# EasyEDA Pro project ProPrj_UNO_SIG_pro_2026-06-11.epro

# Schematic UNO_SIG
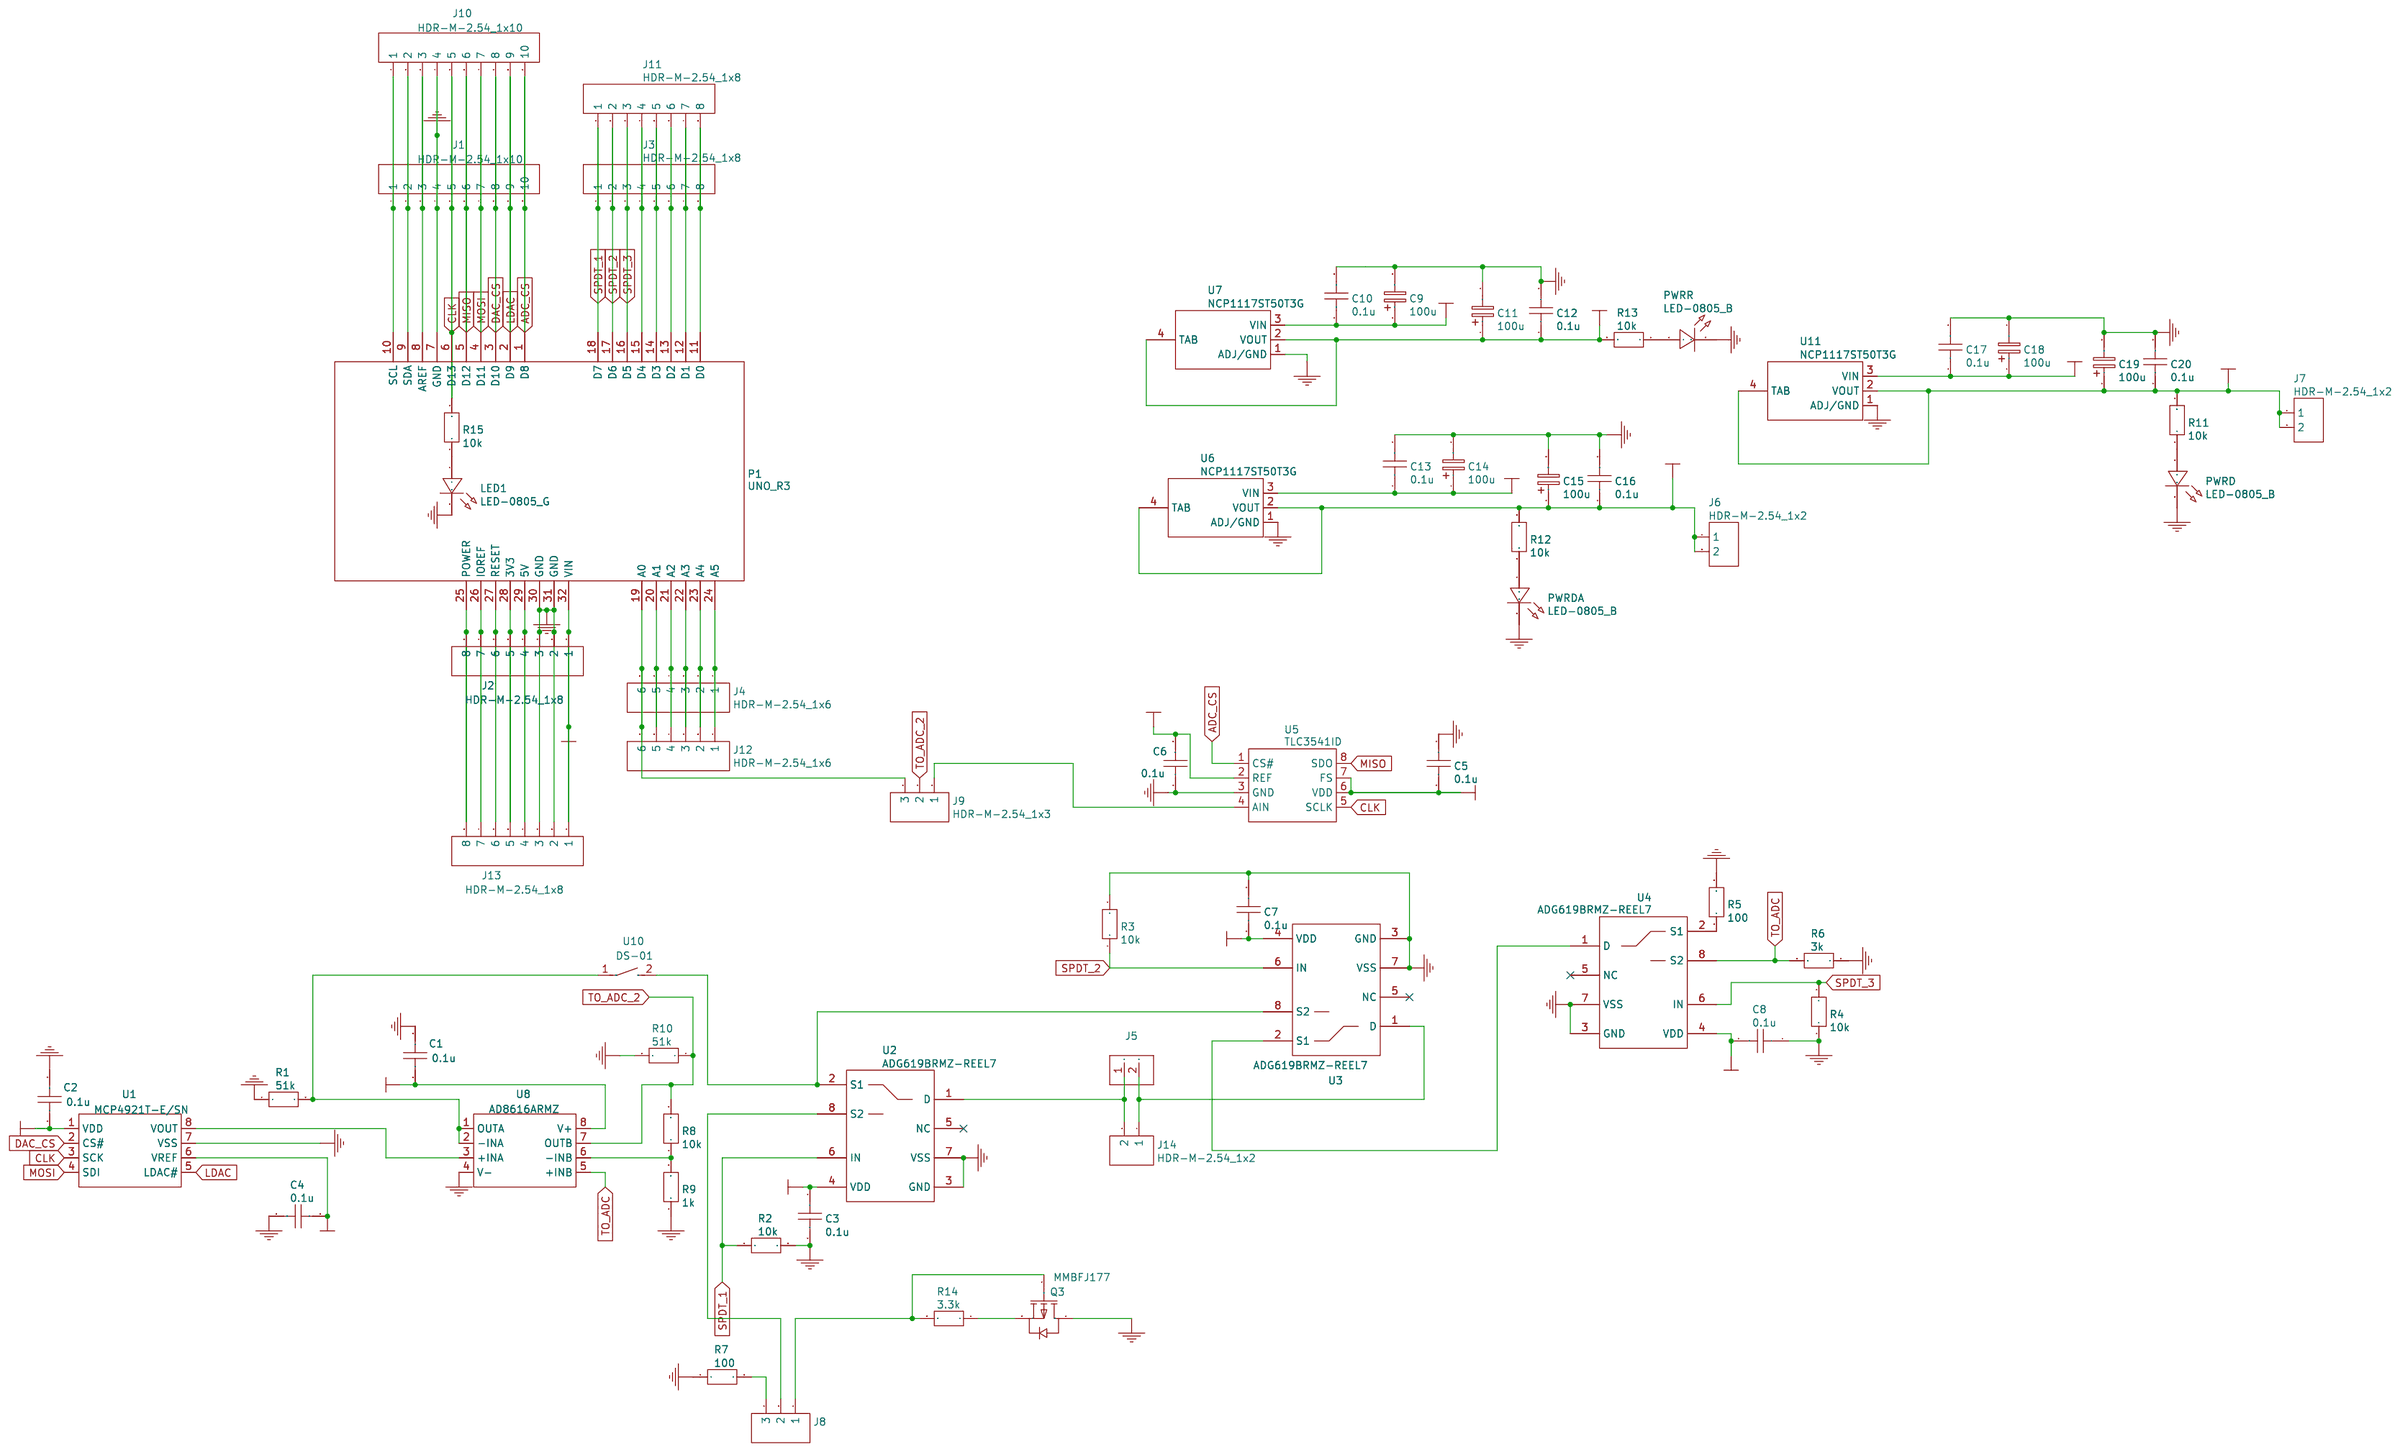
[diagram p0: schematic sheet]

## Parts
C1  0.1u  [C0805]
C2  0.1u  [C0805]
C3  0.1u  [C0805]
C4  0.1u  [C0805]
C5  0.1u  [C0805]
C6  0.1u  [C0805]
C7  0.1u  [C0805]
C8  0.1u  [C0805]
C9  100u  [CAP-D8.0×F3.5]
C10  0.1u  [C0805]
C11  100u  [CAP-D8.0×F3.5]
C12  0.1u  [C0805]
C13  0.1u  [C0805]
C14  100u  [CAP-D8.0×F3.5]
C15  100u  [CAP-D8.0×F3.5]
C16  0.1u  [C0805]
C17  0.1u  [C0805]
C18  100u  [CAP-D8.0×F3.5]
C19  100u  [CAP-D8.0×F3.5]
C20  0.1u  [C0805]
J1  HDR-M-2.54_1x10  [HDR-M-2.54_1X10]
J2  HDR-M-2.54_1x8  [HDR-M-2.54_1X8]
J3  HDR-M-2.54_1x8  [HDR-M-2.54_1X8]
J4  HDR-M-2.54_1x6  [HDR-M-2.54_1X6]
J5  CON_TERMINAL_BLOCK_02-5MM  [TERMINAL_BLOCK_2P_5]
J6  HDR-M-2.54_1x2  [HDR-M-2.54_1X2]
J7  HDR-M-2.54_1x2  [HDR-M-2.54_1X2]
J8  HDR-M-2.54_1x3  [HDR-M-2.54_1X3]
J9  HDR-M-2.54_1x3  [HDR-M-2.54_1X3]
J10  HDR-M-2.54_1x10  [HDR-M-2.54_1X10]
J11  HDR-M-2.54_1x8  [HDR-M-2.54_1X8]
J12  HDR-M-2.54_1x6  [HDR-M-2.54_1X6]
J13  HDR-M-2.54_1x8  [HDR-M-2.54_1X8]
J14  HDR-M-2.54_1x2  [HDR-M-2.54_1X2]
LED1  LED-0805_G  [LED0805_GREEN]
P1  UNO_R3
PWRD  LED-0805_B  [LED0805_BLUE]
PWRDA  LED-0805_B  [LED0805_BLUE]
PWRR  LED-0805_B  [LED0805_BLUE]
Q3  MMBFJ177  [SOT-23-3_L3.0-W1.7-P0.95-LS2.9-BR]
R1  51k  [R1206]
R2  10k  [R1206]
R3  10k  [R1206]
R4  10k  [R1206]
R5  100  [R1206]
R6  3k  [R1206]
R7  100  [R1206]
R8  10k  [R1206]
R9  1k  [R1206]
R10  51k  [R1206]
R11  10k  [R1206]
R12  10k  [R1206]
R13  10k  [R1206]
R14  3.3k  [R1206]
R15  10k  [R1206]
U1  MCP4921T-E/SN  [SOIC-8_L4.9-W3.9-P1.27-LS6.0-BL-2]
U2  ADG619BRMZ-REEL7  [MSOP-8_L3.0-W3.0-P0.65-LS4.9-TL]
U3  ADG619BRMZ-REEL7  [MSOP-8_L3.0-W3.0-P0.65-LS4.9-TL]
U4  ADG619BRMZ-REEL7  [MSOP-8_L3.0-W3.0-P0.65-LS4.9-TL]
U5  TLC3541ID  [SOIC-8_L4.9-W3.9-P1.27-LS6.0-BL]
U6  NCP1117ST50T3G  [SOT-223_L6.5-W3.5-P2.30-LS7.0-BR]
U7  NCP1117ST50T3G  [SOT-223_L6.5-W3.5-P2.30-LS7.0-BR]
U8  AD8616ARMZ  [MSOP-8_L3.0-W3.0-P0.65-LS4.9-BL]
U10  DS-01  [SW-TH_DS-01]
U11  NCP1117ST50T3G  [SOT-223_L6.5-W3.5-P2.30-LS7.0-BR]

## Library data of the parts
C1-C8 C10 C12 C13 C16 C17 C20 = 0.1u
C9 C11 C14 C15 C18 C19 = 100u
J1 J10 = HDR-M-2.54_1x10: Supplier Part: C57369; Supplier: LCSC
J2 J3 J11 J13 = HDR-M-2.54_1x8: Supplier Part: C190820; Supplier: LCSC
J4 J12 = HDR-M-2.54_1x6: Supplier Part: C190819; Supplier: LCSC
J5 = CON_TERMINAL_BLOCK_02-5MM
J6 J7 J14 = HDR-M-2.54_1x2: Supplier Part: C124375; Supplier: LCSC
J8 J9 = HDR-M-2.54_1x3: Supplier Part: C180248; Supplier: LCSC
LED1 = LED-0805_G: Manufacturer: 国星光电; Manufacturer Part: NCD0805G1; Supplier Part: C84260
P1 = UNO_R3
PWRD PWRDA PWRR = LED-0805_B: Manufacturer: 方舟 ARKLED; Manufacturer Part: D-B080508B1-KS2; Supplier Part: C108412
Q3 = MMBFJ177: Supplier: LCSC; Supplier Part: C232842; Manufacturer: onsemi(安森美); JLCPCB Part Class: Extended Part
R1 R10 = 51k
R2-R4 R8 R11-R13 R15 = 10k
R5 R7 = 100
R6 = 3k
R9 = 1k
R14 = 3.3k
U1 = MCP4921T-E/SN: Supplier: LCSC; Supplier Part: C623659; Manufacturer: MICROCHIP(美国微芯); JLCPCB Part Class: Extended Part; link: https://lcsc.com/eda_search?q=C623659&amp;%26type=1&amp;ref=editor
U2-U4 = ADG619BRMZ-REEL7: Supplier: LCSC; Manufacturer: ADI(亚德诺)/LINEAR(凌特); Supplier Part: C141957; JLCPCB Part Class: Extended Part; link: https://lcsc.com/eda_search?q=C141957&amp;%26type=1&amp;ref=editor
U5 = TLC3541ID: Supplier: LCSC; Supplier Part: C1543741; Manufacturer: TI(德州仪器); JLCPCB Part Class: Extended Part; link: https://lcsc.com/eda_search?q=C1543741&amp;%26type=1&amp;ref=editor
U6 U7 U11 = NCP1117ST50T3G: Supplier: LCSC; Manufacturer: onsemi(安森美); Supplier Part: C17314; JLCPCB Part Class: Extended Part; link: https://lcsc.com/eda_search?q=C17314&amp;%26type=1&amp;ref=editor
U8 = AD8616ARMZ: Supplier: LCSC; Supplier Part: C578786; Manufacturer: ADI(亚德诺)/LINEAR(凌特); JLCPCB Part Class: Extended Part; link: https://lcsc.com/eda_search?q=C578786&amp;%26type=1&amp;ref=editor
U10 = DS-01: Supplier: LCSC; Supplier Part: C9900001390; Manufacturer: null; JLCPCB Part Class: Extended Part; link: https://lcsc.com/eda_search?q=C9900001390&amp;%26type=1&amp;ref=editor

## Nets
+12V: C9.1 C10.1 C13.1 C14.1 C17.1 C18.1 J2.1 J13.1 P1.32(VIN) U6.3(VIN) U7.3(VIN) U11.3(VIN)
GND: C1.2 C2.2 C3.2 C4.2 C5.2 C6.1 C7.1 C8.1 C9.2 C10.2 C11.2 C12.2 C13.2 C14.2 C15.2 C16.2 C17.2 C18.2 C19.2 C20.2 J1.4 J2.2 J2.3 J10.4 J13.2 J13.3 LED1.2 P1.7(GND) P1.30(GND) P1.31(GND) PWRD.2 PWRDA.2 PWRR.2 Q3.1(D) R1.1 R2.2 R3.2 R4.1 R5.2 R6.1 R7.1 R9.1 R10.2 U1.7(VSS) U2.3(GND) U2.7(VSS) U3.3(GND) U3.7(VSS) U4.3(GND) U4.7(VSS) U5.3(GND) U6.1(ADJ/GND) U7.1(ADJ/GND) U8.4(V-) U11.1(ADJ/GND)
VCCA: C1.1 C3.1 C7.2 C8.2 C15.1 C16.1 J6.1 J6.2 R12.2 U2.4(VDD) U3.4(VDD) U4.4(VDD) U6.2(VOUT) U6.4(TAB) U8.8(V+)
VCCD: C2.1 C5.1 C19.1 C20.1 J7.1 J7.2 R11.2 U1.1(VDD) U5.6(VDD) U5.7(FS) U11.2(VOUT) U11.4(TAB)
VCCREF: C4.1 C6.2 C11.1 C12.1 R13.2 U1.6(VREF) U5.2(REF) U7.2(VOUT) U7.4(TAB)
ADC_CS: J1.10 J10.10 P1.1(D8) U5.1(CS#)
CLK: J1.5 J10.5 P1.6(D13) R15.2 U1.3(SCK) U5.5(SCLK)
DAC_CS: J1.8 J10.8 P1.3(D10) U1.2(CS#)
LDAC: J1.9 J10.9 P1.2(D9) U1.5(LDAC#)
MISO: J1.6 J10.6 P1.5(D12) U5.8(SDO)
MOSI: J1.7 J10.7 P1.4(D11) U1.4(SDI)
SPDT_1: J3.1 J11.1 P1.18(D7) R2.1 U2.6(IN)
SPDT_2: J3.2 J11.2 P1.17(D6) R3.1 U3.6(IN)
SPDT_3: J3.3 J11.3 P1.16(D5) R4.2 U4.6(IN)
TO_ADC: R6.2 U4.8(S2) U8.5(+INB)
TO_ADC_2: J9.2 R8.2 R10.1 U8.7(OUTB)
J8_3: J8.3 R7.2
LED1_1: LED1.1 R15.1
Net-(J1-1): J1.1 J10.1 P1.10(SCL)
Net-(J1-2): J1.2 J10.2 P1.9(SDA)
Net-(J1-3): J1.3 J10.3 P1.8(AREF)
Net-(J2-4): J2.4 J13.4 P1.29(5V)
Net-(J2-5): J2.5 J13.5 P1.28(3V3)
Net-(J2-6): J2.6 J13.6 P1.27(RESET)
Net-(J2-7): J2.7 J13.7 P1.26(IOREF)
Net-(J2-8): J2.8 J13.8 P1.25(POWER)
Net-(J3-4): J3.4 J11.4 P1.15(D4)
Net-(J3-5): J3.5 J11.5 P1.14(D3)
Net-(J3-6): J3.6 J11.6 P1.13(D2)
Net-(J3-7): J3.7 J11.7 P1.12(D1)
Net-(J3-8): J3.8 J11.8 P1.11(D0)
Net-(J4-1): J4.1 J12.1 P1.24(A5)
Net-(J4-2): J4.2 J12.2 P1.23(A4)
Net-(J4-3): J4.3 J12.3 P1.22(A3)
Net-(J4-4): J4.4 J12.4 P1.21(A2)
Net-(J4-5): J4.5 J12.5 P1.20(A1)
Net-(J4-6): J4.6 J9.3 J12.6 P1.19(A0)
PWRD_1: PWRD.1 R11.1
Q3_2: Q3.2(S) R14.1
Q3_3: J8.1 Q3.3(G) R14.2
R8_1: R8.1 R9.2 U8.6(-INB)
R12_1: PWRDA.1 R12.1
R13_1: PWRR.1 R13.1
U1_8: U1.8(VOUT) U8.3(+INA)
U2_1: J5.1 J14.2 U2.1(D)
U2_2: U2.2(S1) U3.8(S2) U10.2
U2_8: J8.2 U2.8(S2)
U3_1: J5.2 J14.1 U3.1(D)
U3_2: U3.2(S1) U4.1(D)
U4_2: R5.1 U4.2(S1)
U5_4: J9.1 U5.4(AIN)
U10_1: R1.2 U8.1(OUTA) U8.2(-INA) U10.1

Not connected (* = marked no-connect by the designer): U2 5(NC)*; U3 5(NC)*; U4 5(NC)*

# Board UNO_SIG
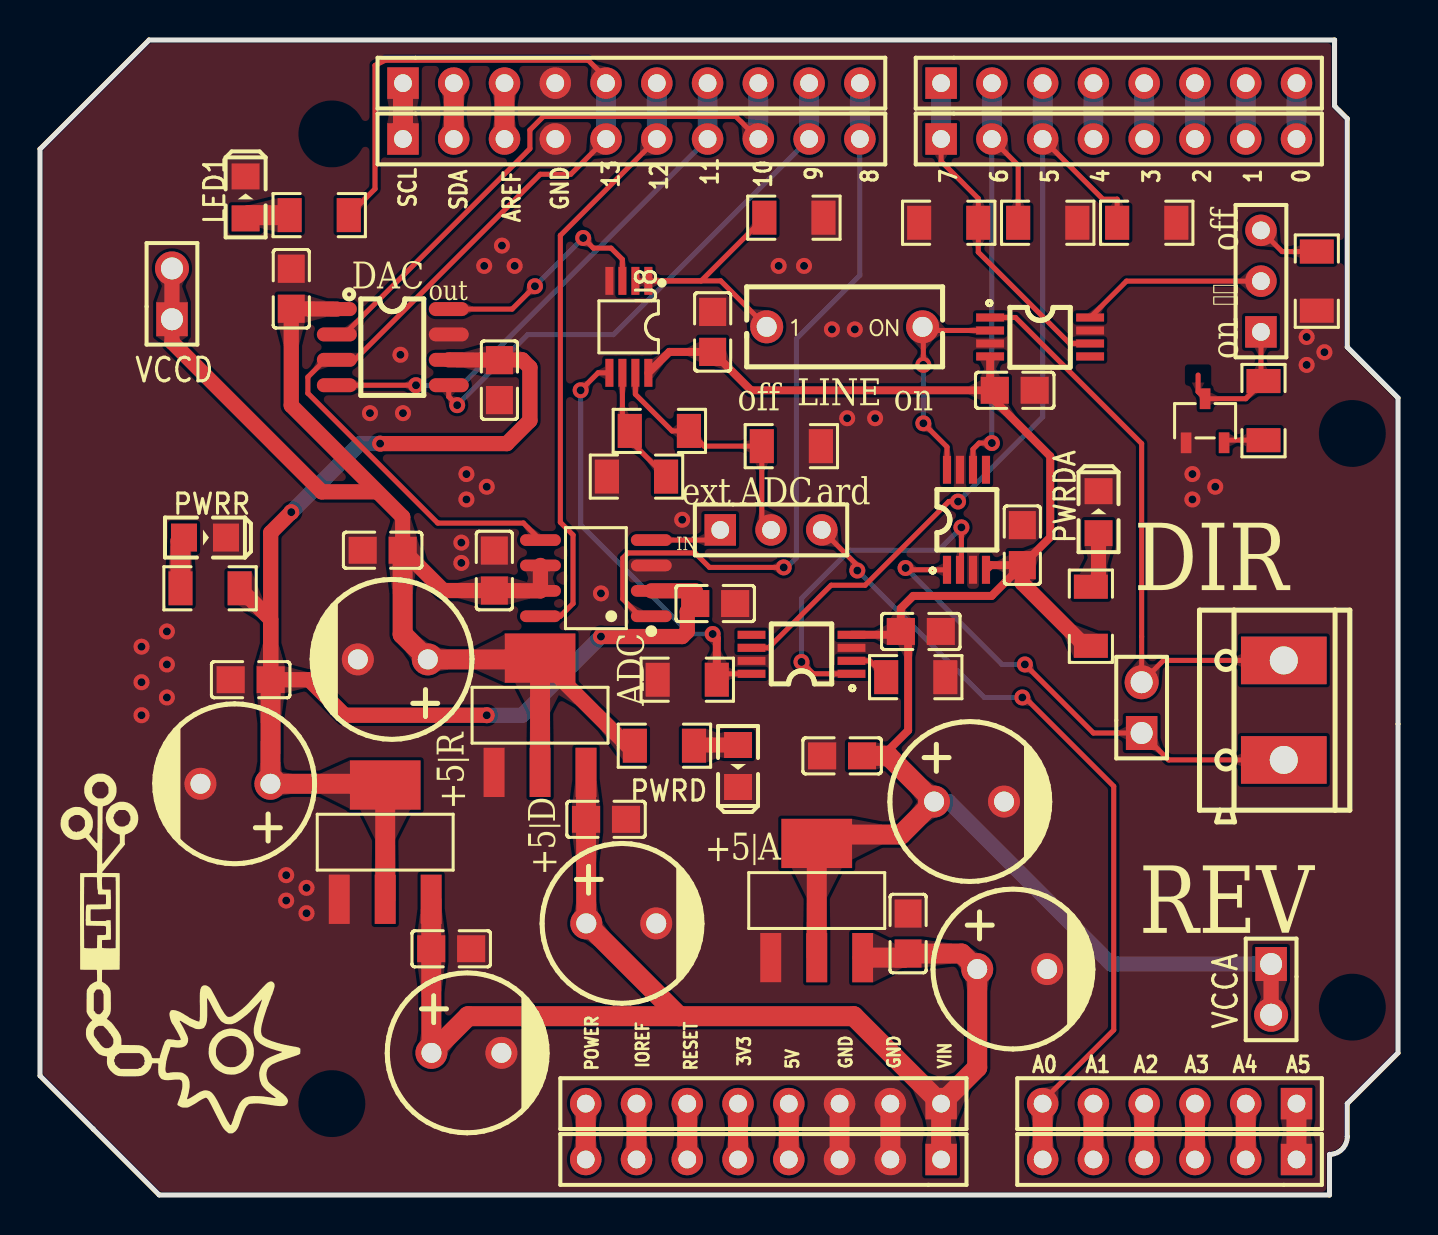
[diagram p1: board, top side]
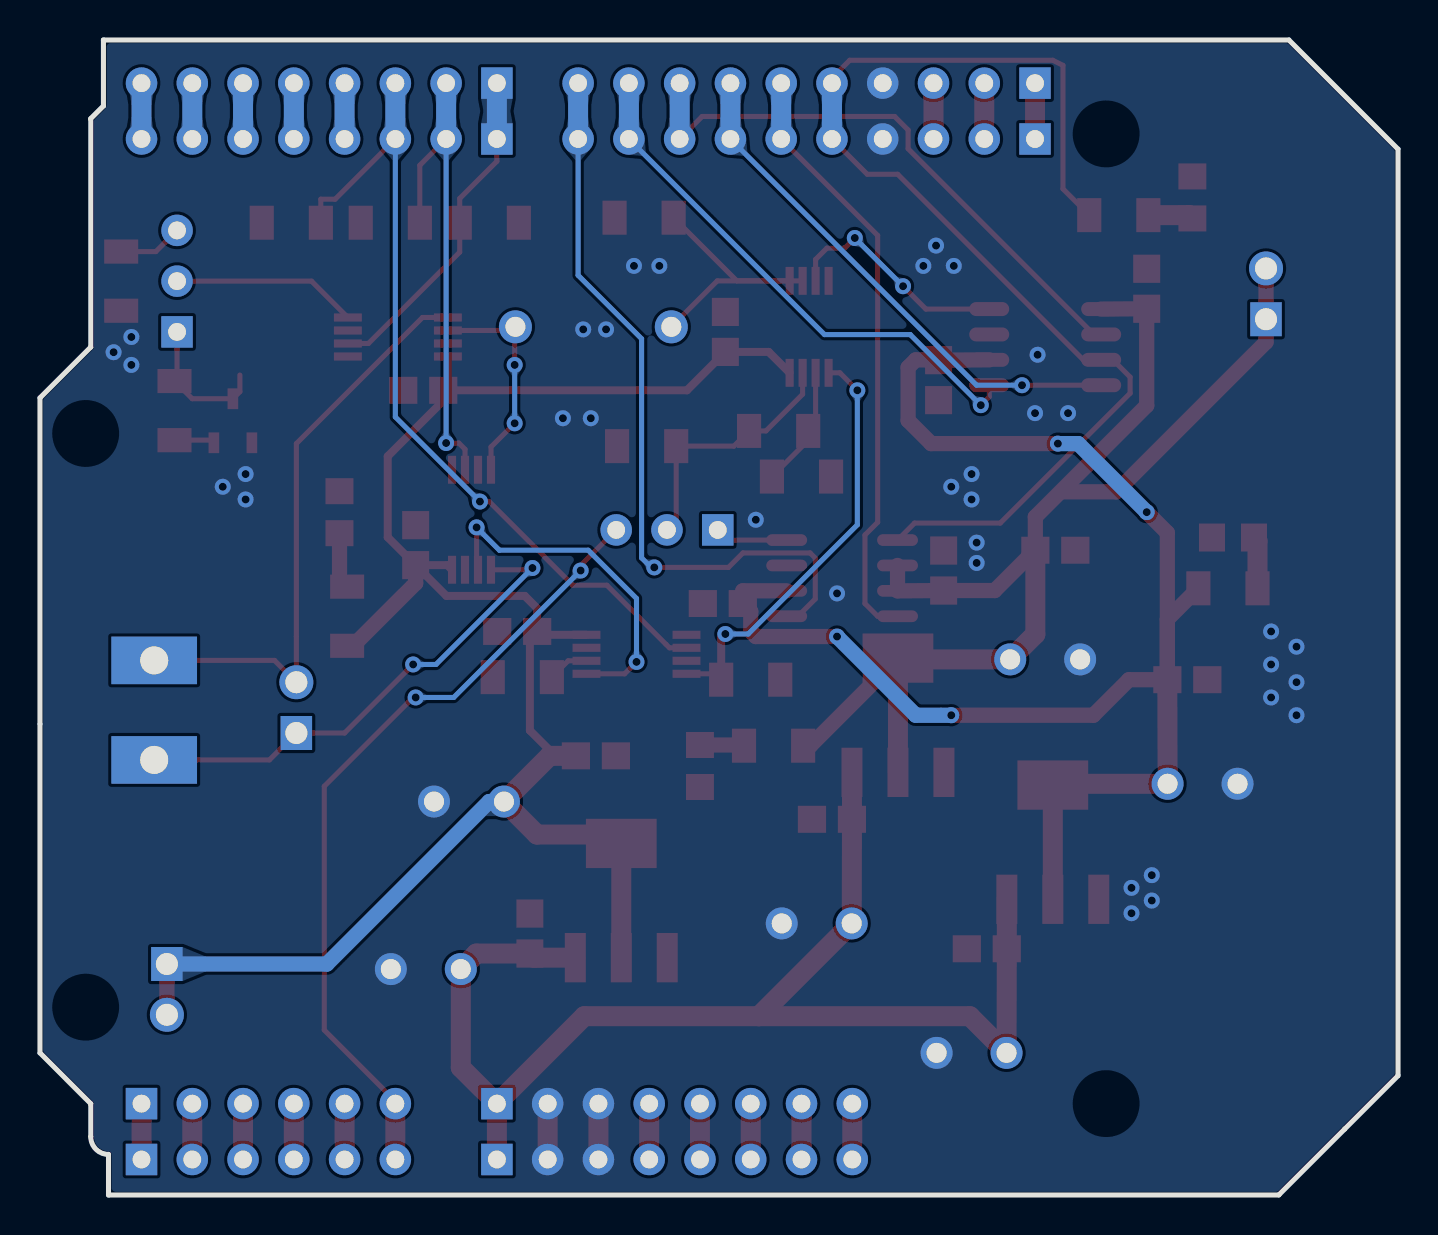
[diagram p2: board, bottom side, seen from below]

Outline 67.94 x 57.78 mm; copper layers: Top Layer, Bottom Layer. Coordinates in mm from the lower left corner of the outline.
Outline path: 0,52.32 0,5.97 5.97,0 64.52,0 64.52,2.03 arc(65.14,2.29) 65.41,2.92 65.41,4.57 67.94,7.11 67.94,39.88 65.41,42.42 65.41,53.85 64.77,54.48 64.77,57.78 5.46,57.78 0,52.32

## Design rules (mm)
spacing Default (default): track to track 0.201, other pairs 0 to 0.201
track width Default (default): min 0.254, default 0.254, max 25.4
via Default (default): diameter min 0.8, default 0.8, max 100.025; hole min 0.4, default 0.4, max 59.995
pour e104 uses gge13019
pour e565 uses gge12902

## Placement (name value [footprint] x y rotation side)
C1  0.1u  [C0805]  33.66 43.18 90 top
C2  0.1u  [C0805]  12.57 45.34 90 top
C3  0.1u  [C0805]  48.77 40.26 0 top
C4  0.1u  [C0805]  22.99 40.77 270 top
C5  0.1u  [C0805]  22.73 31.24 90 top
C6  0.1u  [C0805]  33.78 29.59 180 top
C7  0.1u  [C0805]  49.15 32.51 270 top
C8  0.1u  [C0805]  44.07 28.19 180 top
C9  100u  [CAP-D8.0×F3.5]  21.34 7.11 0 top
C10  0.1u  [C0805]  20.57 12.32 0 top
C11  100u  [CAP-D8.0×F3.5]  9.78 20.57 180 top
C12  0.1u  [C0805]  10.54 25.78 180 top
C13  0.1u  [C0805]  43.43 13.08 90 top
C14  100u  [CAP-D8.0×F3.5]  48.64 11.3 0 top
C15  100u  [CAP-D8.0×F3.5]  46.48 19.68 0 top
C16  0.1u  [C0805]  40.13 21.97 180 top
C17  0.1u  [C0805]  28.32 18.8 0 top
C18  100u  [CAP-D8.0×F3.5]  29.08 13.59 0 top
C19  100u  [CAP-D8.0×F3.5]  17.65 26.8 180 top
C20  0.1u  [C0805]  17.14 32.26 180 top
J1  HDR-M-2.54_1x10  [HDR-M-2.54_1X10]  29.59 52.83 0 top
J2  HDR-M-2.54_1x8  [HDR-M-2.54_1X8]  34.92 4.57 180 top
J3  HDR-M-2.54_1x8  [HDR-M-2.54_1X8]  55.25 52.83 0 top
J4  HDR-M-2.54_1x6  [HDR-M-2.54_1X6]  56.51 4.57 180 top
J5  CON_TERMINAL_BLOCK_02-5MM  [TERMINAL_BLOCK_2P_5]  62.23 24.26 90 top
J6  HDR-M-2.54_1x2  [HDR-M-2.54_1X2]  61.59 10.29 270 top
J7  HDR-M-2.54_1x2  [HDR-M-2.54_1X2]  6.6 45.08 90 top
J8  HDR-M-2.54_1x3  [HDR-M-2.54_1X3]  61.09 45.72 90 top
J9  HDR-M-2.54_1x3  [HDR-M-2.54_1X3]  36.58 33.27 0 top
J10  HDR-M-2.54_1x10  [HDR-M-2.54_1X10]  29.59 55.63 0 top
J11  HDR-M-2.54_1x8  [HDR-M-2.54_1X8]  55.25 55.63 0 top
J12  HDR-M-2.54_1x6  [HDR-M-2.54_1X6]  56.51 1.78 180 top
J13  HDR-M-2.54_1x8  [HDR-M-2.54_1X8]  34.92 1.78 180 top
J14  HDR-M-2.54_1x2  [HDR-M-2.54_1X2]  55.12 24.38 90 top
LED1  LED-0805_G  [LED0805_GREEN]  10.29 49.91 90 top
PWRD  LED-0805_B  [LED0805_BLUE]  34.92 21.46 270 top
PWRDA  LED-0805_B  [LED0805_BLUE]  52.96 34.16 90 top
PWRR  LED-0805_B  [LED0805_BLUE]  8.25 32.89 0 top
Q3  MMBFJ177  [SOT-23-3_L3.0-W1.7-P0.95-LS2.9-BR]  58.29 38.73 270 top
R1  51k  [R1206]  37.72 48.89 180 top
R2  10k  [R1206]  45.47 48.64 180 top
R3  10k  [R1206]  50.42 48.64 0 top
R4  10k  [R1206]  55.37 48.64 180 top
R5  100  [R1206]  43.81 25.91 0 top
R6  3k  [R1206]  32.38 25.78 0 top
R7  100  [R1206]  63.88 45.72 90 top
R8  10k  [R1206]  30.99 38.23 0 top
R9  1k  [R1206]  29.84 35.94 0 top
R10  51k  [R1206]  37.59 37.46 0 top
R11  10k  [R1206]  31.24 22.48 180 top
R12  10k  [R1206]  52.58 28.96 270 top
R13  10k  [R1206]  8.51 30.35 0 top
R14  3.3k  [R1206]  61.21 39.24 90 top
R15  10k  [R1206]  13.97 49.02 0 top
U1  MCP4921T-E/SN  [SOIC-8_L4.9-W3.9-P1.27-LS6.0-BL-2]  17.65 42.42 270 top
U2  ADG619BRMZ-REEL7  [MSOP-8_L3.0-W3.0-P0.65-LS4.9-TL]  50.04 42.93 0 top
U3  ADG619BRMZ-REEL7  [MSOP-8_L3.0-W3.0-P0.65-LS4.9-TL]  46.35 33.78 90 top
U4  ADG619BRMZ-REEL7  [MSOP-8_L3.0-W3.0-P0.65-LS4.9-TL]  38.1 27.05 180 top
U5  TLC3541ID  [SOIC-8_L4.9-W3.9-P1.27-LS6.0-BL]  27.81 30.86 90 top
U6  NCP1117ST50T3G  [SOT-223_L6.5-W3.5-P2.30-LS7.0-BR]  38.86 14.73 270 top
U7  NCP1117ST50T3G  [SOT-223_L6.5-W3.5-P2.30-LS7.0-BR]  17.27 17.65 270 top
U8  AD8616ARMZ  [MSOP-8_L3.0-W3.0-P0.65-LS4.9-BL]  29.46 43.43 180 top
U10  DS-01  [SW-TH_DS-01]  40.26 43.43 0 top
U11  NCP1117ST50T3G  [SOT-223_L6.5-W3.5-P2.30-LS7.0-BR]  25.02 24 270 top

## Footprints (pads in the part's own frame, mm; a bottom-side part is the same pattern mirrored in y, then rotated)
C0805
  rect 1.41x1.35 smd: 1(-1,0) 2(1,0)
CAP-D8.0×F3.5
  round 1.6 hole 1: 1(-1.75,0) 2(1.75,0)
HDR-M-2.54_1X2
  rect 1.7x1.575 hole 1.1: 1(-1.27,0)
  round 1.7 hole 1.1: 2(1.27,0)
HDR-M-2.54_1X3
  rect 1.575x1.575 hole 0.889: 1(-2.54,0)
  round 1.575 hole 0.889: 2(0,0) 3(2.54,0)
HDR-M-2.54_1X6
  rect 1.575x1.575 hole 0.889: 1(-6.35,0)
  round 1.575 hole 0.889: 2(-3.81,0) 3(-1.27,0) 4(1.27,0) 5(3.81,0) 6(6.35,0)
HDR-M-2.54_1X8
  rect 1.575x1.575 hole 0.889: 1(-10.16,0)
  round 1.575 hole 0.889: 2(-7.62,0) 3(-5.08,0) 4(-2.54,0) 5(0,0) 6(2.54,0) 7(5.08,0) 8(7.62,0)
HDR-M-2.54_1X10
  rect 1.575x1.575 hole 0.889: 1(-11.43,0)
  round 1.575 hole 0.889: 2(-8.89,0) 3(-6.35,0) 4(-3.81,0) 5(-1.27,0) 6(1.27,0) 7(3.81,0) 8(6.35,0) 9(8.89,0) 10(11.43,0)
LED0805_BLUE
  rect 1.3x1.399 smd: 1(-1.05,0) 2(1.05,0)
LED0805_GREEN
  rect 1.3x1.399 smd: 1(-1.05,0) 2(1.05,0)
MSOP-8_L3.0-W3.0-P0.65-LS4.9-BL
  rect 0.406x1.397 smd: 1(-0.975,-2.3) 2(-0.325,-2.3) 3(0.325,-2.3) 4(0.975,-2.3) 5(0.975,2.3) 6(0.325,2.3) 7(-0.325,2.3) 8(-0.975,2.3)
MSOP-8_L3.0-W3.0-P0.65-LS4.9-TL
  rect 1.397x0.406 smd: 1(-2.502,0.975) 2(-2.502,0.325) 3(-2.502,-0.325) 4(-2.502,-0.975) 5(2.502,-0.975) 6(2.502,-0.325) 7(2.502,0.325) 8(2.502,0.975)
R1206
  rect 1.208x1.701 smd: 1(-1.479,0) 2(1.479,0)
SOIC-8_L4.9-W3.9-P1.27-LS6.0-BL
  oval 0.588x2.045 smd: 1(-1.905,-2.772) 2(-0.635,-2.772) 3(0.635,-2.772) 4(1.905,-2.772) 5(1.905,2.772) 6(0.635,2.772) 7(-0.635,2.772) 8(-1.905,2.772)
SOIC-8_L4.9-W3.9-P1.27-LS6.0-BL-2
  oval 0.7x2 smd: 1(-1.905,-2.8) 2(-0.635,-2.8) 3(0.635,-2.8) 4(1.905,-2.8) 5(1.905,2.8) 6(0.635,2.8) 7(-0.635,2.8) 8(-1.905,2.8)
SOT-23-3_L3.0-W1.7-P0.95-LS2.9-BR
  rect 1.038x0.532 smd: 1(1.101,-0.95) 2(1.101,0.95) 3(-1.101,0)
SOT-223_L6.5-W3.5-P2.30-LS7.0-BR
  rect 2.465x1.05 smd: 1(2.857,-2.3) 2(2.857,0) 3(2.857,2.3)
  rect 2.465x3.54 smd: 4(-2.857,0)
SW-TH_DS-01
  round 1.65 hole 1: 1(-3.9,0) 2(3.9,0)
TERMINAL_BLOCK_2P_5
  rect 2.38x4.285 hole 1.402: 1(2.489,0) 2(-2.489,0)

## Nets
+12V: C9.1 C10.1 C13.1 C14.1 C17.1 C18.1 J2.1 J13.1 U6.3 U7.3 U11.3
GND: C1.2 C2.2 C3.2 C4.2 C5.2 C6.1 C7.1 C8.1 C9.2 C10.2 C11.2 C12.2 C13.2 C14.2 C15.2 C16.2 C17.2 C18.2 C19.2 C20.2 J1.4 J2.2 J2.3 J10.4 J13.2 J13.3 LED1.2 PWRD.2 PWRDA.2 PWRR.2 Q3.1 R1.1 R2.2 R3.2 R4.1 R5.2 R6.1 R7.1 R9.1 R10.2 U1.7 U2.3 U2.7 U3.3 U3.7 U4.3 U4.7 U5.3 U6.1 U7.1 U8.4 U11.1
VCCA: C1.1 C3.1 C7.2 C8.2 C15.1 C16.1 J6.1 J6.2 R12.2 U2.4 U3.4 U4.4 U6.2 U6.4 U8.8
VCCD: C2.1 C5.1 C19.1 C20.1 J7.1 J7.2 R11.2 U1.1 U5.6 U5.7 U11.2 U11.4
VCCREF: C4.1 C6.2 C11.1 C12.1 R13.2 U1.6 U5.2 U7.2 U7.4
ADC_CS: J1.10 J10.10 U5.1
CLK: J1.5 J10.5 R15.2 U1.3 U5.5
DAC_CS: J1.8 J10.8 U1.2
J8_3: J8.3 R7.2
LDAC: J1.9 J10.9 U1.5
LED1_1: LED1.1 R15.1
MISO: J1.6 J10.6 U5.8
MOSI: J1.7 J10.7 U1.4
P1_8: J1.3 J10.3
P1_9: J1.2 J10.2
P1_10: J1.1 J10.1
P1_11: J3.8 J11.8
P1_12: J3.7 J11.7
P1_13: J3.6 J11.6
P1_14: J3.5 J11.5
P1_15: J3.4 J11.4
P1_19: J4.6 J9.3 J12.6
P1_20: J4.5 J12.5
P1_21: J4.4 J12.4
P1_22: J4.3 J12.3
P1_23: J4.2 J12.2
P1_24: J4.1 J12.1
P1_25: J2.8 J13.8
P1_26: J2.7 J13.7
P1_27: J2.6 J13.6
P1_28: J2.5 J13.5
P1_29: J2.4 J13.4
PWRD_1: PWRD.1 R11.1
Q3_2: Q3.2 R14.1
Q3_3: J8.1 Q3.3 R14.2
R8_1: R8.1 R9.2 U8.6
R12_1: PWRDA.1 R12.1
R13_1: PWRR.1 R13.1
SPDT_1: J3.1 J11.1 R2.1 U2.6
SPDT_2: J3.2 J11.2 R3.1 U3.6
SPDT_3: J3.3 J11.3 R4.2 U4.6
TO_ADC: R6.2 U4.8 U8.5
TO_ADC_2: J9.2 R8.2 R10.1 U8.7
U1_8: U1.8 U8.3
U2_1: J5.1 J14.2 U2.1
U2_2: U2.2 U3.8 U10.2
U2_8: J8.2 U2.8
U3_1: J5.2 J14.1 U3.1
U3_2: U3.2 U4.1
U4_2: R5.1 U4.2
U5_4: J9.1 U5.4
U10_1: R1.2 U8.1 U8.2 U10.1

Pads without a net: U2 5; U3 5; U4 5

## Via types
v1: diameter 0.8, hole 0.4, Top Layer to Bottom Layer, 56 vias

## Routing (per net, layer and track width the routed paths; a pad name or vN(x,y) marks a point on that pad's centre or on a via; arc(x,y) is an arc through that point)
+12V: length 66.3
  Top Layer w1: 31.98,8.95 C18.1 C17.1 U11.3 ; 31.98,8.95 40.71,8.95 J2.1 ; 31.98,8.95 21.42,8.95 C9.1 19.57,12.32 U7.3 ; J2.1 J13.1 ; J2.1 46.89,6.38 C14.1 46.11,12.08 C13.1 43.23,11.87 41.16,11.87
GND: length 5.6
  Top Layer w1: J2.2 J13.2 ; J2.3 J13.3
  vias: v1(5.08,27.43) v1(5.08,25.65) v1(5.08,24) v1(6.35,28.19) v1(6.35,26.54) v1(6.35,24.89) v1(12.32,16) v1(12.32,14.73) v1(13.34,15.37) v1(13.34,14.1) v1(16.51,39.12) v1(18.03,42.04) v1(18.16,39.12) v1(21.08,32.64) v1(21.08,31.62) v1(21.34,36.07) v1(21.34,34.8) v1(22.22,46.48) v1(22.35,35.43) v1(23.11,47.5) v1(23.75,46.48) v1(28.07,30.1) v1(32.13,33.78) v1(36.96,46.48) v1(38.23,46.48) v1(39.62,43.31) v1(40.39,38.86) v1(40.77,43.31) v1(41.78,38.86) v1(57.66,36.07) v1(57.66,34.8) v1(58.8,35.43) v1(63.37,42.93) v1(63.37,41.53) v1(64.26,42.16)
VCCA: length 96.7
  Top Layer w0.4: U3.4 47.56,31.51 C7.2 ; 30.44,41.14 31.49,42.18 C1.1 35.57,40.26 C3.1 ; C8.2 43.43,27.83 43.43,23.24 42.16,21.97 C16.1 ; C8.2 43.07,29.35 43.69,29.97 47.61,29.97 C7.2 ; C8.2 42.9,28.03 U4.4 ; C7.2 50.55,32.91 50.55,36.96 47.77,39.74 C3.1 ; C3.1 47.54,40.49 47.54,41.95
  Top Layer w0.762: C7.2 49.15,30.61 52.28,27.48 52.58,27.48 ; 61.59,11.56 J6.2
  Top Layer w1: C16.1 42.45,21.97 C15.1 43.08,18.03 39.31,18.03 U6.4 U6.2
  Bottom Layer w0.762: C15.1 45.47,19.68 53.59,11.56 61.59,11.56
VCCD: length 66.5
  Top Layer w0.762: U11.4 29.4,22.48 29.76,22.48 ; 14.85,44.32 12.57,44.34 12.57,39.5 18.15,33.92 18.15,32.26 18.16,32.26 20.18,30.24 22.73,30.24 U5.7 U5.6 ; J7.2 J7.1 6.6,42.67 14.1,35.18 16.78,35.18
  Top Layer w1: U11.2 U11.4 24.96,26.8 C19.1 18.15,28.05 18.15,32.26
VCCREF: length 79.1
  Top Layer w0.762: R13.2 11.54,28.8 11.54,25.78 ; 11.54,25.78 11.54,33.13 v1(12.57,34.16) ; 11.54,25.78 13.46,25.78 15.24,24 v1(22.35,24) ; v1(17.02,37.59) 23.36,37.59 24.51,38.75 24.51,41.4 24.13,41.78 C4.1 U1.6 ; U5.2 32.78,30.23 32.78,29.59 32.38,29.19 32.38,28.19 32.13,27.94 v1(28.07,27.94)
  Top Layer w1: 11.54,25.78 C11.1 17.21,20.57 U7.4 U7.2
  Bottom Layer w0.762: v1(22.35,24) 24.13,24 v1(28.07,27.94) ; v1(17.02,37.59) 16,37.59 v1(12.57,34.16)
ADC_CS: length 38.2
  Top Layer w0.254: U5.1 30.02,28.96 29.16,29.82 29.16,31.86 29.41,32.12 32.78,32.12 33.5,31.4 37.21,31.4
  Bottom Layer w0.254: v1(37.21,31.4) 37.37,31.4 37.85,31.88 37.85,42.84 41.02,46.01 41.02,52.83
  Bottom Layer w1: 41.02,55.63 41.02,52.83
CLK: length 58.4
  Top Layer w0.254: U5.5 24.19,33.62 19.9,33.62 13.4,40.11 13.4,40.92 14.26,41.78 15.75,41.78 25.03,51.07 26.56,51.07 J1.5 ; J10.5 28.32,55.88 27.43,56.77 17.27,56.77 16.76,56.52 16.76,50.34 15.45,49.02
  Bottom Layer w1: J10.5 J1.5
DAC_CS: length 29.4
  Top Layer w0.254: J1.8 34.82,53.96 25.18,53.96 24.51,53.28 24.51,52.34 15.22,43.05 14.85,43.05
  Bottom Layer w1: J10.8 J1.8
J8_3: length 3.2
  Top Layer w0.254: J8.3 62.15,47.2 63.88,47.2
LDAC: length 27.1
  Top Layer w0.254: v1(20.87,39.52) 20.45,39.94 U1.5
  Bottom Layer w0.254: J1.9 28.7,43.05 24.4,43.05 v1(20.87,39.52)
  Bottom Layer w1: J10.9 J1.9
LED1_1: length 2.3
  Top Layer w1: 12.49,49.02 10.45,49.02 LED1.1
MISO: length 30.2
  Top Layer w0.254: 30.86,52.83 26.03,48.01 26.03,33.66 26.67,33.02 26.67,29.59 26.03,28.96 U5.8
  Bottom Layer w1: 30.86,55.63 30.86,52.83
MOSI: length 26.4
  Top Layer w0.254: 14.85,40.51 v1(18.81,40.51)
  Bottom Layer w0.254: 33.4,52.83 21.08,40.51 v1(18.81,40.51)
  Bottom Layer w1: 33.4,55.63 33.4,52.83
P1_8: length 2.8
  Top Layer w1: 23.24,55.63 23.24,52.83
P1_9: length 2.8
  Top Layer w1: 20.7,55.63 20.7,52.83
P1_10: length 2.8
  Top Layer w1: J10.1 J1.1
P1_11: length 2.8
  Bottom Layer w1: J3.8 J11.8
P1_12: length 2.8
  Bottom Layer w1: 60.32,52.83 60.32,55.63
P1_13: length 2.8
  Bottom Layer w1: J11.6 J3.6
P1_14: length 2.8
  Bottom Layer w1: J11.5 J3.5
P1_15: length 2.8
  Bottom Layer w1: 52.7,55.63 52.7,52.83
P1_19: length 40.2
  Top Layer w0.254: v1(49.15,24.89) 49.28,24.89 53.72,20.45 53.72,8.25 50.16,4.7 J4.6 ; J9.3 40.89,31.5 v1(40.89,31.24)
  Top Layer w1: J4.6 J12.6
  Bottom Layer w0.254: v1(40.89,31.24) 47.24,24.89 v1(49.15,24.89)
P1_20: length 2.8
  Top Layer w1: J4.5 J12.5
P1_21: length 2.8
  Top Layer w1: J4.4 J12.4
P1_22: length 2.8
  Top Layer w1: J4.3 J12.3
P1_23: length 2.8
  Top Layer w1: J4.2 J12.2
P1_24: length 2.8
  Top Layer w1: J4.1 J12.1
P1_25: length 2.8
  Top Layer w1: J2.8 J13.8
P1_26: length 2.8
  Top Layer w1: J2.7 J13.7
P1_27: length 2.8
  Top Layer w1: J2.6 J13.6
P1_28: length 2.8
  Top Layer w1: J2.5 J13.5
P1_29: length 2.8
  Top Layer w1: J2.4 J13.4
PWRD_1: length 2.2
  Top Layer w0.762: PWRD.1 32.76,22.51 R11.1
Q3_2: length 2
  Top Layer w0.254: R14.1 59.37,37.76 59.24,37.63
Q3_3: length 7.1
  Top Layer w0.254: 57.94,41.02 57.94,40.19 58.29,39.84 60.33,39.84 R14.2 61.09,40.85 J8.1
R8_1: length 6.1
  Top Layer w0.254: 29.14,41.14 29.14,38.6 29.51,38.23 29.51,37.75 R9.2
R12_1: length 2.8
  Top Layer w0.762: PWRDA.1 52.96,30.82 52.58,30.43
R13_1: length 2.6
  Top Layer w1: R13.1 7.03,32.72 PWRR.1
SPDT_1: length 16.7
  Top Layer w0.254: J3.1 45.09,51.72 46.94,49.85 46.94,47.17 51.51,42.6 U2.6
  Bottom Layer w1: J11.1 J3.1
SPDT_2: length 24.8
  Top Layer w0.254: U3.6 46.68,37.31 ; R3.1 48.94,51.52 J3.2 ; v1(47.62,37.62) 46.99,37.62 46.68,37.31
  Bottom Layer w0.254: J3.2 v1(47.62,37.62)
  Bottom Layer w1: J11.2 J3.2
SPDT_3: length 42.2
  Top Layer w0.254: v1(45.93,34.69) 45.47,34.69 41.28,30.51 39.58,30.51 36.63,27.55 ; 53.89,48.64 53.89,49.82 ; U4.6 36.45,27.38 36.62,27.55 ; 53.89,49.82 53.18,49.82 J3.3
  Bottom Layer w0.254: v1(45.93,34.69) 50.16,38.92 J3.3
  Bottom Layer w1: J11.3 J3.3
TO_ADC: length 21.8
  Top Layer w0.254: U4.8 33.86,26.08 R6.2 ; v1(27.05,40.26) 27.92,41.14 28.49,41.14
  Top Layer w0.4: v1(33.66,28.07) 33.86,27.86 R6.2
  Bottom Layer w0.254: v1(27.05,40.26) 27.05,33.53 32.51,28.07 v1(33.66,28.07)
TO_ADC_2: length 12.9
  Top Layer w0.254: J9.2 36.11,33.74 36.11,37.46 33.23,37.46 32.47,38.23 31.62,38.23 29.79,40.06 29.79,41.14
U1_8: length 11.7
  Top Layer w0.254: U1.8 23.62,44.32 v1(24.76,45.47) ; v1(27.18,47.88) 27.69,47.37 28.57,47.37 29.14,46.81 29.14,45.73
  Bottom Layer w0.254: v1(27.18,47.88) v1(24.76,45.47)
U2_1: length 29.7
  Top Layer w0.254: 47.54,43.9 48.81,43.9 55.12,37.59 J14.2 56.21,26.75 J5.1
U2_2: length 11.1
  Top Layer w0.254: v1(44.2,38.61) 45.38,37.42 U3.8 ; 44.16,43.43 44.34,43.25 U2.2 ; U10.2 44.2,43.4 v1(44.2,41.53)
  Bottom Layer w0.254: v1(44.2,41.53) v1(44.2,38.61)
U2_8: length 9.3
  Top Layer w0.254: J8.2 54.36,45.72 52.54,43.9
U3_1: length 25
  Top Layer w0.254: U3.1 43.4,31.28 v1(43.31,31.37) ; J5.2 56.46,21.77 J14.1 52.7,23.11 v1(49.28,26.54)
  Bottom Layer w0.254: v1(43.31,31.37) 48.13,26.54 v1(49.28,26.54)
U3_2: length 17.5
  Top Layer w0.254: U3.2 46.1,31.35 v1(46.1,33.4) ; U4.1 38.69,26.08 v1(38.1,26.67)
  Bottom Layer w0.254: v1(46.1,33.4) 44.96,32.26 40.51,32.26 38.1,29.84 v1(38.1,26.67)
U4_2: length 2.1
  Top Layer w0.254: R5.1 41.52,26.73 U4.2
U5_4: length 4
  Top Layer w0.254: U5.4 34.04,32.77 J9.1
U10_1: length 14.6
  Top Layer w0.254: R1.2 33.08,45.73 30.44,45.73 ; 30.44,45.73 34.06,45.73 36.36,43.43 ; 30.44,45.73 29.79,45.73

## Copper pours and planes (outline as drawn; the poured copper is in the pictures)
GND on Top Layer: -4.19,59.18 -2.98,56.32 -2.98,-2.35 -2.35,-1.71 73.72,-1.71 72.71,-0.7 72.9,58.93
GND on Bottom Layer: -7.49,60.32 -8.26,59.56 -8.26,-6.73 -7.11,-5.59 70.1,-5.59 69.72,-5.21 69.72,60.96

Small or netless copper shapes (teardrops, artwork), in the pictures only: 213 on Top Layer, 56 on Bottom Layer

## Text on the board
Top Silkscreen Layer: POWER | IOREF | RESET | 3V3 | 5V | GND | VIN | A0 | A1 | A2 | A3 | A4 | A5 | 9 | 8 | 7 | 6 | 5 | 4 | 3 | 2 | 1 | 0 | SCL | SDA | AREF | 13 | 12 | 11 | 10 | VCCD | VCCA | IN | out | DAC | ext | +5|A | off | ADC | LINE | ard | on | +5|R | +5|D | СС | DIR | REV
